# Altium schematic sheet Arduino Micro Breakout Board_V1.0.schdoc
size 477 x 272 mm
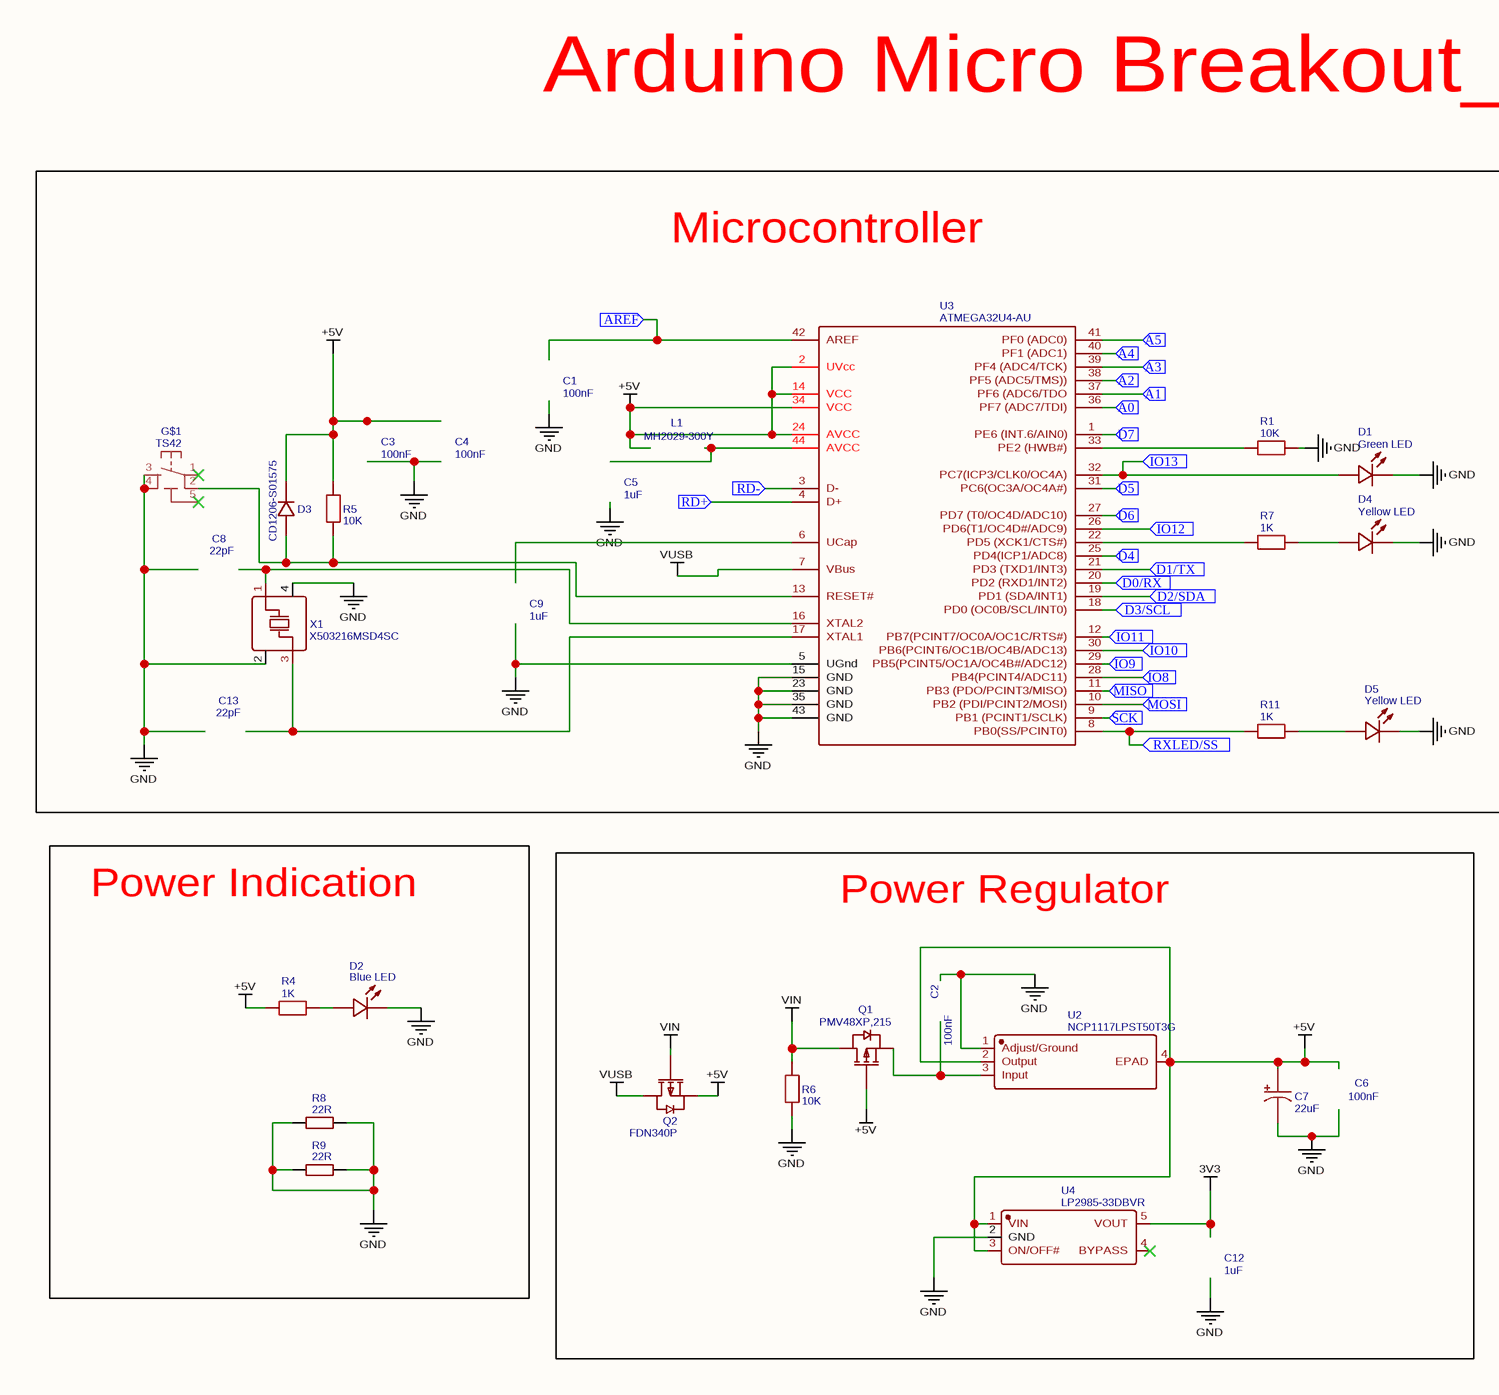
[diagram p0: Arduino Micro Breakout Board_V1.0.schdoc, left]
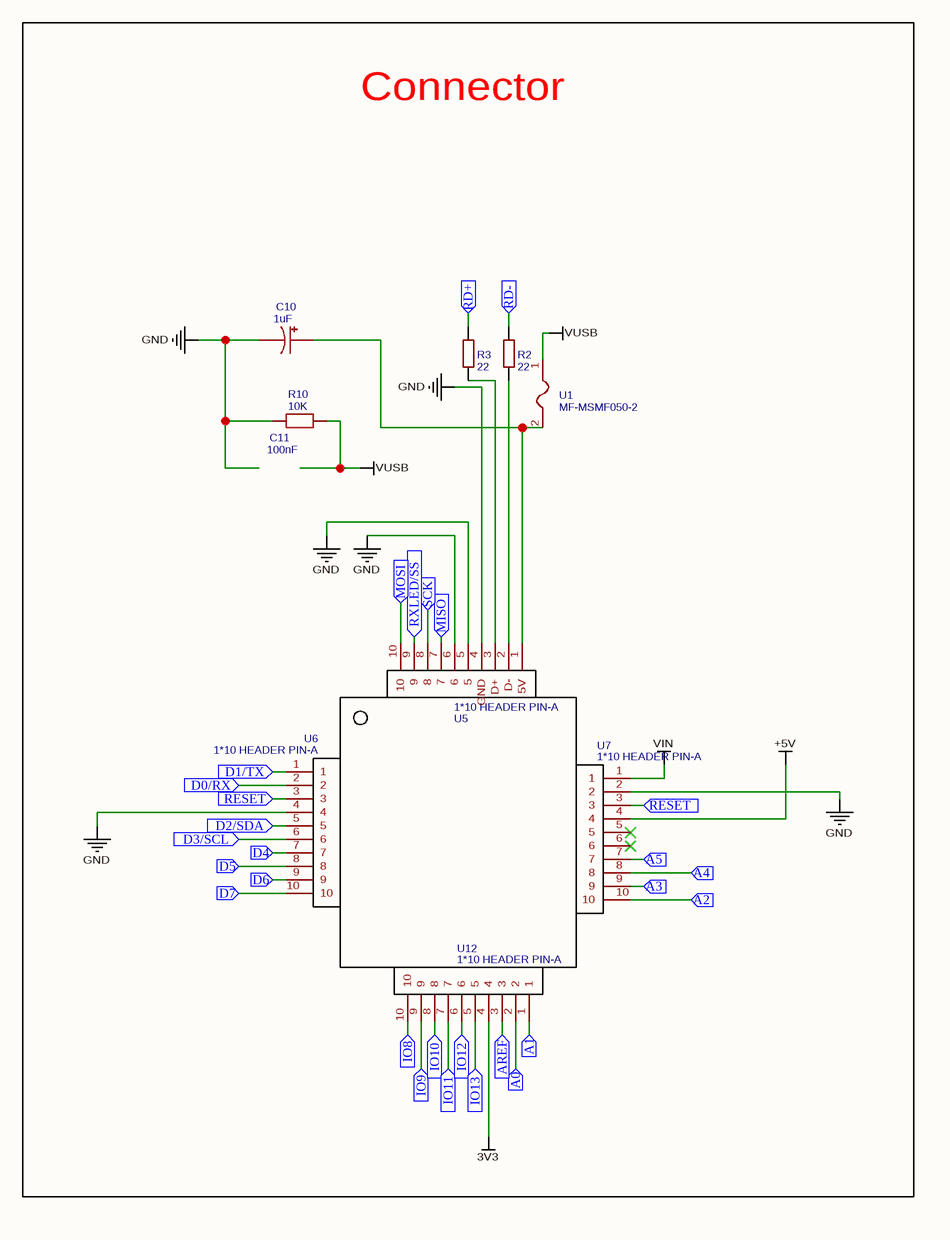
[diagram p1: Arduino Micro Breakout Board_V1.0.schdoc, right]

## Parts
C1  100nF  [0805]
C2  100nF  [0805]
C3  100nF  [0805]
C4  100nF  [0805]
C5  1uF  [0805]
C6  100nF  [0805]
C7  22uF  [CAP-SMD_L3.2-W1.6-R-RD]
C8  22pF  [0805]
C9  1uF  [0805]
C10  1uF  [CAP-SMD_L3.2-W1.6-R-RD]
C11  100nF  [0805]
C12  1uF  [0805]
C13  22pF  [0805]
D1  Green LED  [LED 0603]
D2  Blue LED  [LED 0603]
D3  CD1206-S01575  [D1206-RD]
D4  Yellow LED  [LED 0603]
D5  Yellow LED  [LED 0603]
G$1  TS42  [TS42]
L1  MH2029-300Y  [0805]
Q1  PMV48XP,215  [SOT-23-3_L2.9-W1.6-P1.90-LS2.8-BR]
Q2  FDN340P  [SOT-23-3_L2.9-W1.6-P1.90-LS2.8-BR]
R1  10K  [R0805]
R2  22  [R0805]
R3  22  [R0805]
R4  1K  [R0805]
R5  10K  [R0805]
R6  10K  [R0805]
R7  1K  [R0805]
R8  22R  [R0805]
R9  22R  [R0805]
R10  10K  [R0805]
R11  1K  [R0805]
U1  MF-MSMF050-2  [F1812]
U2  NCP1117LPST50T3G  [SOT-223_L6.5-W3.5-P2.30-LS7.0-BR]
U3  ATMEGA32U4-AU  [QFP-44_L10.0-W10.0-P0.80-LS13.2-BL]
U4  LP2985-33DBVR  [SOT-23-5_L3.0-W1.7-P0.95-LS2.8-BL]
U5  1*10 HEADER PIN-A  [1*10 HEADER PIN-A]
U6  1*10 HEADER PIN-A  [1*10 HEADER PIN-A]
U7  1*10 HEADER PIN-A  [1*10 HEADER PIN-A]
U12  1*10 HEADER PIN-A  [1*10 HEADER PIN-A]
X1  X503216MSD4SC  [OSC-SMD_4P-L5.0-W3.2-BL]

## Blocks framed on the sheet
Microcontroller: C1 C3-C5 C8 C9 C13 D1 D3-D5 G$1 L1 R1 R5 R7 R11 U3 X1
Connector: C10 C11 R2 R3 R10 U1 U5-U7 U12
Power Indication: D2 R4 R8 R9
Power Regulator: C2 C6 C7 C12 Q1 Q2 R6 U2 U4

## Ports
A0 (in), A1 (in), A2 (in), A3 (in), A4 (in), A5 (in), AREF (in), D0/RX (in), D1/TX (in), D2/SDA (in), D3/SCL (in), D4 (in), D5 (in), D6 (in), D7 (in), IO8 (in), IO9 (in), IO10 (in), IO11 (in), IO12 (in), IO13 (in), MISO (in), MOSI (in), RD+ (in), RD- (in), RESET (in), RXLED/SS (in), SCK (in)

## Nets
3V3: U4.5(VOUT) U12.4
+5V: C7.1 D3.1(K) Q1.1(G) Q2.2(S) R4.2 R5.2 U2.2(Output) U2.4(EPAD) U3.2(UVcc) U3.14(VCC) U3.24(AVCC) U3.34(VCC) U4.1(VIN) U4.3(ON/OFF#) U7.4
GND: C7.2 C10.2 D1.K D2.K D4.K D5.K G$1.3 G$1.4 R1.1 R6.1 R8.1 R8.2 R9.1 R9.2 R10.1 U2.1(Adjust/Ground) U3.5(UGnd) U3.15(GND) U3.23(GND) U3.35(GND) U3.43(GND) U4.2(GND) U5.4(GND) U5.5 U5.6 U6.4 U7.2 X1.2(GND) X1.4(GND)
VIN: Q1.3(D) Q2.1(G) R6.2 U7.1
VUSB: Q2.3(D) R10.2 U1.1 U3.7(VBus)
A0: U3.36(PF7_(ADC7/TDI)) U12.2 ; port A0
A1: U3.37(PF6_(ADC6/TDO) U12.1 ; port A1
A2: U3.38(PF5_(ADC5/TMS))) U7.10 ; port A2
A3: U3.39(PF4_(ADC4/TCK)) U7.9 ; port A3
A4: U3.40(PF1_(ADC1)) U7.8 ; port A4
A5: U3.41(PF0_(ADC0)) U7.7 ; port A5
AREF: U3.42(AREF) U12.3 ; port AREF
D0/RX: U3.20(PD2_(RXD1/INT2)) U6.2 ; port D0/RX
D1/TX: U3.21(PD3_(TXD1/INT3)) U6.1 ; port D1/TX
D2/SDA: U3.19(PD1_(SDA/INT1)) U6.5 ; port D2/SDA
D3/SCL: U3.18(PD0_(OC0B/SCL/INT0)) U6.6 ; port D3/SCL
D4: U3.25(PD4(ICP1/ADC8)) U6.7 ; port D4
D5: U3.31(PC6(OC3A/OC4A#)) U6.8 ; port D5
D6: U3.27(PD7_(T0/OC4D/ADC10)) U6.9 ; port D6
D7: U3.1(PE6_(INT.6/AIN0)) U6.10 ; port D7
IO8: U3.28(PB4(PCINT4/ADC11)) U12.10 ; port IO8
IO9: U3.29(PB5(PCINT5/OC1A/OC4B#/ADC12)) U12.9 ; port IO9
IO10: U3.30(PB6(PCINT6/OC1B/OC4B/ADC13)) U12.8 ; port IO10
IO11: U3.12(PB7(PCINT7/OC0A/OC1C/RTS#)) U12.7 ; port IO11
IO12: U3.26(PD6(T1/OC4D#/ADC9)) U12.6 ; port IO12
IO13: D1.A U3.32(PC7(ICP3/CLK0/OC4A)) U12.5 ; port IO13
MISO: U3.11(PB3_(PDO/PCINT3/MISO)) U5.7 ; port MISO
MOSI: U3.10(PB2_(PDI/PCINT2/MOSI)) U5.10 ; port MOSI
RD+: R3.1 U3.4(D+) ; port RD+
RD-: R2.1 U3.3(D-) ; port RD-
RESET: U6.3 U7.3 ; port RESET
RXLED/SS: R11.2 U3.8(PB0(SS/PCINT0)) U5.9 ; port RXLED/SS
SCK: U3.9(PB1_(PCINT1/SCLK)) U5.8 ; port SCK
NetC10_1: C10.1 U1.2 U5.1(5V)
NetD2_A: D2.A R4.1
NetD3_2: D3.2(A) G$1.2 R5.1 U3.13(RESET#)
NetD4_A: D4.A R7.1
NetD5_A: D5.A R11.1
NetQ1_2: Q1.2(S) U2.3(Input)
NetR1_2: R1.2 U3.33(PE2_(HWB#))
NetR2_2: R2.2 U5.2(D-)
NetR3_2: R3.2 U5.3(D+)
NetR7_2: R7.2 U3.22(PD5_(XCK1/CTS#))
NetU3_16: U3.16(XTAL2) X1.1(OSC1)
NetU3_17: U3.17(XTAL1) X1.3(OSC2)

Not connected (* = marked no-connect by the designer): G$1 1* 5(5-GND)*; U3 6(UCap) 44(AVCC); U4 4(BYPASS)*; U7 5* 6*

## Notes on the sheet
- Arduino Micro Breakout_V1.0

## Library data of the parts
C1-C4 C6 C11 = 100nF: BOM_Manufacturer: SAMSUNG; BOM_Manufacturer Part: CL21A106KQFNNN; nameAlias: Capacitance; BOM_Supplier: LCSC; BOM_Supplier Part: C96445; spicePre: C; spiceSymbolName: CL21A106KQFNNN
C5 C9 C12 = 1uF: BOM_Manufacturer: SAMSUNG; BOM_Manufacturer Part: CL21A106KQFNNN; nameAlias: Capacitance; BOM_Supplier: LCSC; BOM_Supplier Part: C96445; spicePre: C; spiceSymbolName: CL21A106KQFNNN
C7 = 22uF: BOM_Manufacturer: Shenzhen Zhenhua XinYun Elec; BOM_Manufacturer Part: CA45-A-16V-1uF-K; nameAlias: Capacitance; Contributor: LCSC; SMT Type: Extend; BOM_Supplier: LCSC; BOM_Supplier Part: C140386; BOM_LCSC Assembly: Yes; spicePre: C; spiceSymbolName: CA45-A-16V-1UF-K
C8 C13 = 22pF: BOM_Manufacturer: WTC; BOM_Manufacturer Part: 0805N101J101; nameAlias: Capacitance; BOM_Supplier: LCSC; BOM_Supplier Part: C77481; spicePre: C; spiceSymbolName: 0805N101J101
C10 = 1uF: BOM_Manufacturer: Shenzhen Zhenhua XinYun Elec; BOM_Manufacturer Part: CA45-A-16V-1uF-K; nameAlias: Capacitance; Contributor: LCSC; SMT Type: Extend; BOM_Supplier: LCSC; BOM_Supplier Part: C140386; BOM_LCSC Assembly: Yes; spicePre: C; spiceSymbolName: CA45-A-16V-1UF-K
D1 = Green LED: nameAlias: Model; BOM_Manufacturer Part: ?; spicePre: D; spiceSymbolName: LED; BOM_Supplier: LCSC; BOM_Supplier Part: C12624
D2 = Blue LED: nameAlias: Model; BOM_Manufacturer Part: ?; spicePre: D; spiceSymbolName: LED; BOM_Supplier: LCSC; BOM_Supplier Part: C2288
D3 = CD1206-S01575: BOM_Manufacturer: BOURNS; Contributor: LCSC; SMT Type: Extend; BOM_Supplier: LCSC; BOM_Supplier Part: C75465; BOM_Manufacturer Part: CD1206-S01575; BOM_LCSC Assembly: Yes; spicePre: D; spiceSymbolName: CD1206-S01575
D4 D5 = Yellow LED: nameAlias: Model; BOM_Manufacturer Part: ?; spicePre: D; spiceSymbolName: LED; BOM_Supplier: LCSC; BOM_Supplier Part: C2287
G$1 = TS42: Contributor: Bo Hyeon Lee; spicePre: G; spiceSymbolName: TS42
L1 = MH2029-300Y: Contributor: MNR324; spicePre: L; spiceSymbolName: 0001_BLM21PG300SN1D_/_MH2029-300Y
Q1 = PMV48XP,215: BOM_Manufacturer: Nexperia; SMT Type: Extend; BOM_Supplier: LCSC; BOM_Manufacturer Part: PMV48XP,215; BOM_Supplier Part: C75560; BOM_LCSC Assembly: Yes; spicePre: Q; spiceSymbolName: PMV48XP,215
Q2 = FDN340P: BOM_Manufacturer: FAIRCHILD; SMT Type: Extend; BOM_Supplier: LCSC; BOM_Manufacturer Part: FDN340P; BOM_Supplier Part: C75469; BOM_LCSC Assembly: Yes; spicePre: Q; spiceSymbolName: FDN340P
R1 R5 R6 R10 = 10K: BOM_Manufacturer: Ever Ohms Tech; BOM_Manufacturer Part: CR0805J110KP05; nameAlias: Resistance (Ohms); Contributor: LCSC; BOM_Supplier: LCSC; BOM_Supplier Part: C428984; spicePre: R; spiceSymbolName: CR0805J110KP05
R2 R3 = 22: BOM_Manufacturer: YAGEO; BOM_Manufacturer Part: RC0805FR-0722RL; nameAlias: Resistance (Ohms); BOM_Supplier: LCSC; BOM_Supplier Part: C107702; spicePre: R; spiceSymbolName: RC0805FR-0722RL
R4 R7 R11 = 1K: BOM_Manufacturer: Ever Ohms Tech; BOM_Manufacturer Part: CR0805J110KP05; nameAlias: Resistance (Ohms); Contributor: LCSC; BOM_Supplier: LCSC; BOM_Supplier Part: C428984; spicePre: R; spiceSymbolName: CR0805J110KP05
R8 R9 = 22R: BOM_Manufacturer: YAGEO; BOM_Manufacturer Part: RC0805FR-0722RL; nameAlias: Resistance (Ohms); BOM_Supplier: LCSC; BOM_Supplier Part: C107702; spicePre: R; spiceSymbolName: RC0805FR-0722RL
U1 = MF-MSMF050-2: BOM_Manufacturer: BOURNS; BOM_Supplier: LCSC; BOM_Manufacturer Part: MF-MSMF050-2; BOM_Supplier Part: C17313; spicePre: U; spiceSymbolName: MF-MSMF050-2
U2 = NCP1117LPST50T3G: BOM_Manufacturer: ON Semicon; Contributor: LCSC; SMT Type: Extend; BOM_Supplier: LCSC; BOM_Supplier Part: C185806; BOM_Manufacturer Part: NCP1117LPST50T3G; BOM_LCSC Assembly: Yes; spicePre: U; spiceSymbolName: NCP1117LPST50T3G
U3 = ATMEGA32U4-AU: BOM_Manufacturer: MICROCHIP; SMT Type: Extend; BOM_Supplier: LCSC; BOM_Manufacturer Part: ATMEGA32U4-AU; image: //image.lceda.cn/szlcsc/C44854.jpg; BOM_Supplier Part: C44854; BOM_LCSC Assembly: Yes; spicePre: U; spiceSymbolName: ATMEGA32U4-AU
U4 = LP2985-33DBVR: BOM_Manufacturer: TI; SMT Type: Extend; BOM_Supplier: LCSC; BOM_Manufacturer Part: LP2985-33DBVR; BOM_Supplier Part: C95414; BOM_LCSC Assembly: Yes; spicePre: U; spiceSymbolName: LP2985-33DBVR
U5-U7 U12 = 1*10 HEADER PIN-A: Contributor: amitd_ucn; spicePre: U; spiceSymbolName: 1*10 HEADER PIN-A
X1 = X503216MSD4SC: BOM_Manufacturer: YXC; Value: 16MHZ; BOM_Supplier Part: C70680; BOM_Supplier: LCSC; BOM_Manufacturer Part: X503216MSD4SC; image: http://image.lceda.cn/szlcsc/C70680.jpg; spicePre: X; spiceSymbolName: X503216MSD4SC